# Altium schematic sheet Sheet1.SchDoc
size A; SheetNumber: 1; SheetTotal: 1
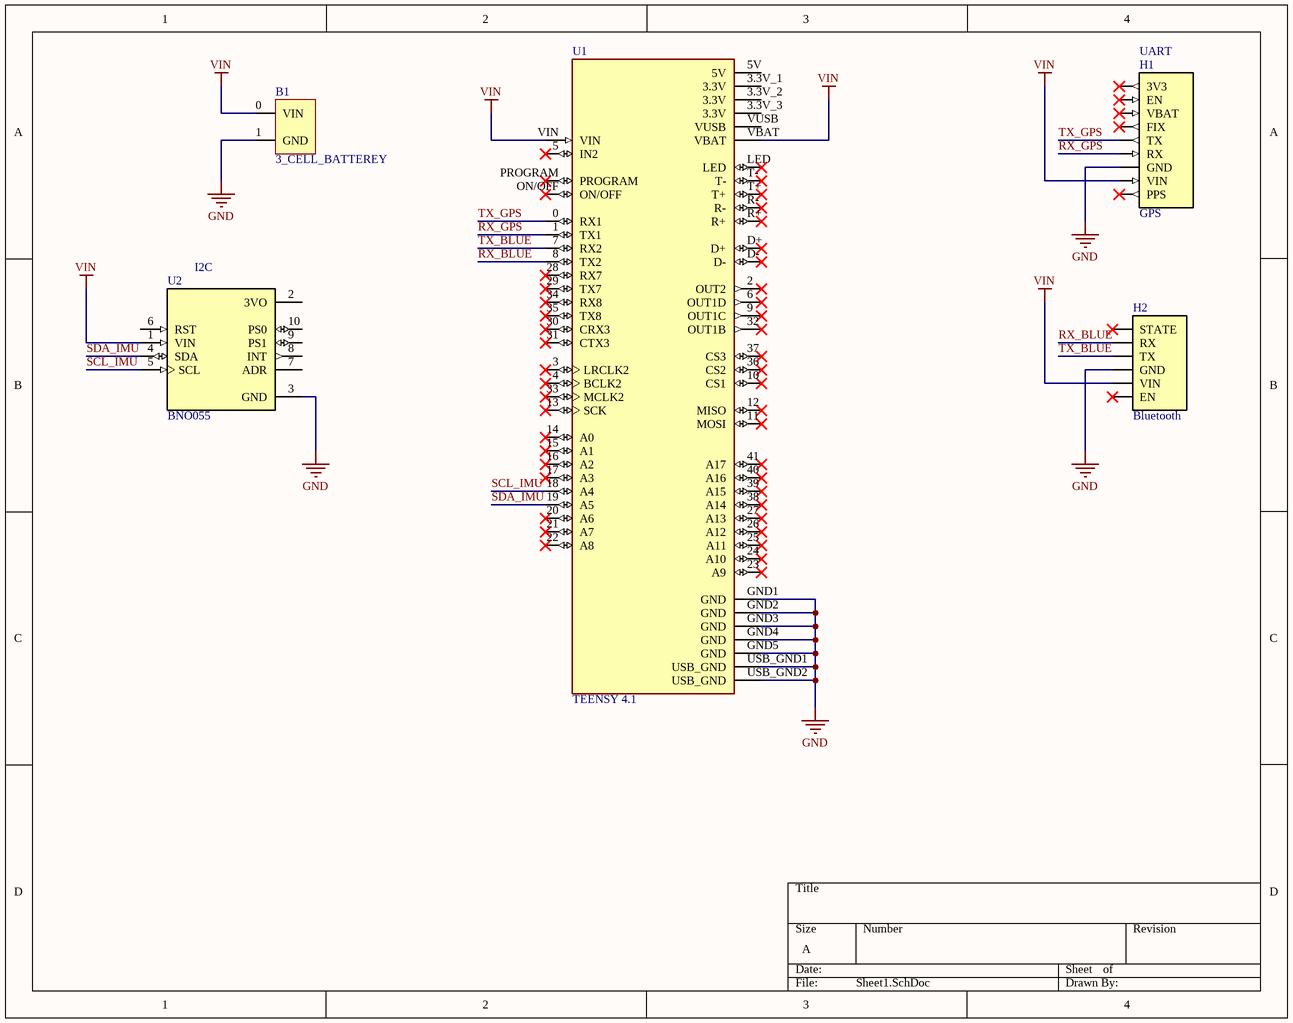
[diagram p0: Sheet1.SchDoc]

## Parts
B1  3_CELL_BATTEREY  [3_CELL_BATTEREY]
H1  GPS  [9X1_header]
H2  Bluetooth  [61300611121]
U1  TEENSY 4.1  [MODULE_DEV-16771]
U2  BNO055  [MODULE_2472]

## Nets
GND: B1.1(GND) H1.6(GND) H2.4(GND) U1.GND1(GND) U1.GND2(GND) U1.GND3(GND) U1.GND4(GND) U1.GND5(GND) U1.USB_GND1(USB_GND) U1.USB_GND2(USB_GND) U2.3(GND)
VIN: B1.0(VIN) H1.7(VIN) H2.5(VIN) U1.VBAT U1.VIN U2.1(VIN)
RX_BLUE: H2.2(RX) U1.8(TX2)
RX_GPS: H1.5(RX) U1.1(TX1)
SCL_IMU: U1.18(A4) U2.5(SCL)
SDA_IMU: U1.19(A5) U2.4(SDA)
TX_BLUE: H2.3(TX) U1.7(RX2)
TX_GPS: H1.4(TX) U1.0(RX1)

Not connected (* = marked no-connect by the designer): H1 0(3V3)* 1(EN)* 2(VBAT)* 3(FIX)* 8(PPS)*; H2 1(STATE)* 6(EN)*; U1 2(OUT2)* 3(LRCLK2)* 3.3V_1(3.3V) 3.3V_2(3.3V) 3.3V_3(3.3V) 4(BCLK2)* 5(IN2)* 5V 6(OUT1D)* 9(OUT1C)* 10(CS1)* 11(MOSI)* 12(MISO)* 13(SCK)* 14(A0)* 15(A1)* 16(A2)* 17(A3)* 20(A6)* 21(A7)* 22(A8)* 23(A9)* 24(A10)* 25(A11)* 26(A12)* 27(A13)* 28(RX7)* 29(TX7)* 30(CRX3)* 31(CTX3)* 32(OUT1B)* 33(MCLK2)* 34(RX8)* 35(TX8)* 36(CS2)* 37(CS3)* 38(A14)* 39(A15)* 40(A16)* 41(A17)* D+* D-* LED* ON/OFF* PROGRAM* R+* R-* T+* T-* VUSB; U2 2(3VO) 6(RST) 7(ADR) 8(INT) 9(PS1) 10(PS0)

## Notes on the sheet
- (near H1) UART
- (near U2) I2C

## Library data of the parts
H1 = 9x1_header
U1 = DEV-16771_1: RT1062 Teensy 4.1 series ARM® Cortex®-M7 MPU Embedded Evaluation Board; MF: SparkFun Electronics; SnapEDA_Link: https://www.snapeda.com/parts/DEV-16771/SparkFun+Electronics/view-part/?ref=snap; Package: None; Value: *; MP: DEV-16771; Check_prices: https://www.snapeda.com/parts/DEV-16771/SparkFun+Electronics/view-part/?ref=eda
U2 = 2472: Adafruit 9-DOF Absolute Orientation IMU Fusion Breakout - BNO055 | Adafruit Industries 2472; SnapEDA_Link: https://www.snapeda.com/parts/2472/Adafruit+Industries/view-part/?ref=snap; Package: Non-Standard Adafruit; Value: *; MF: Adafruit; MP: 2472; Check_prices: https://www.snapeda.com/parts/2472/Adafruit+Industries/view-part/?ref=eda